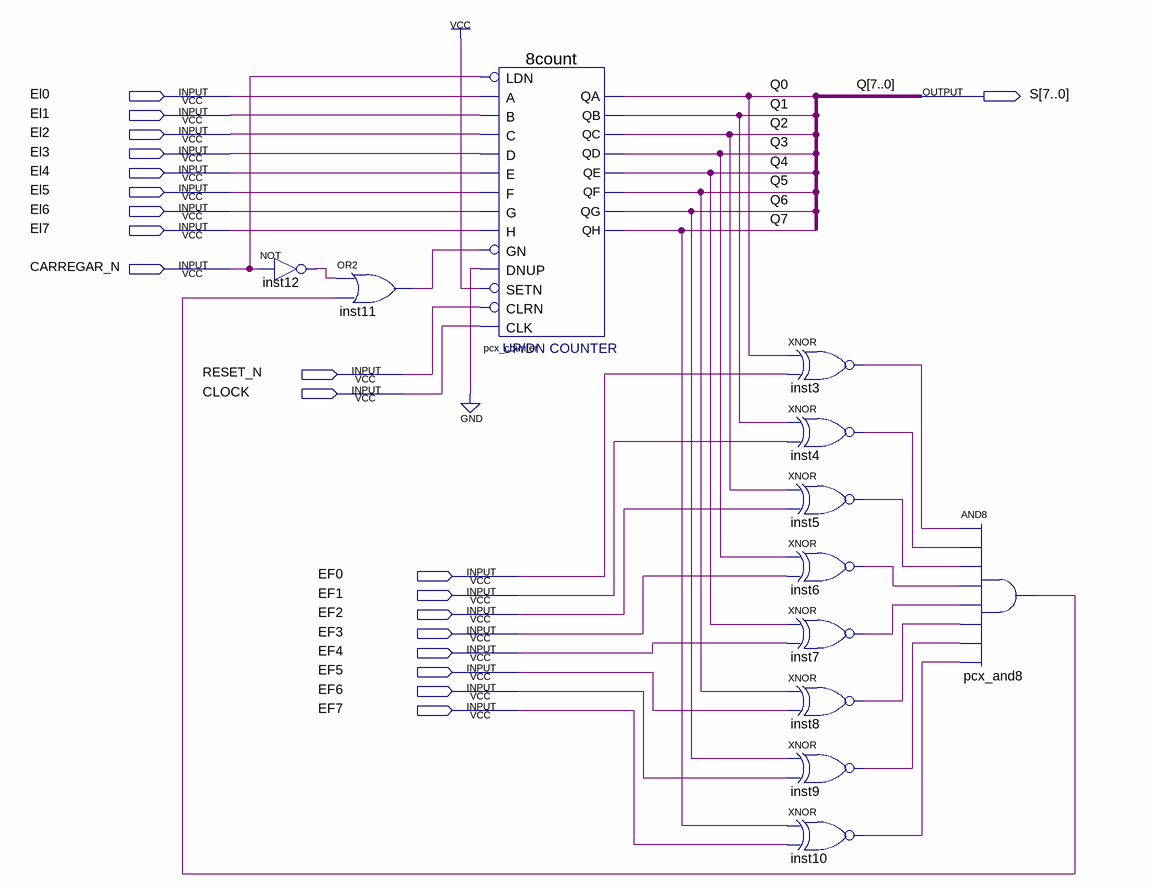
[diagram p0: schematic sheet]
// Quartus schematic PCX.bdf as structural Verilog: 12 symbols, 20 pins
module PCX (
  input  El0,
  input  El1,
  input  El2,
  input  El3,
  input  El4,
  input  El5,
  input  El6,
  input  El7,
  input  CARREGAR_N,
  input  RESET_N,
  input  CLOCK,
  input  EF0,
  input  EF1,
  input  EF2,
  input  EF3,
  input  EF4,
  input  EF5,
  input  EF6,
  input  EF7,
  output [7:0] S
);

  wire inst3_out, inst4_out, inst5_out, inst6_out, inst7_out, inst8_out, inst9_out, inst10_out, inst11_out,
       inst12_out, pcx_and8_out;

  not inst12 (inst12_out, CARREGAR_N);
  or inst11 (inst11_out, inst12_out, pcx_and8_out);
  \8count  pcx_counter (
    .B(El1), .A(El0), .LDN(CARREGAR_N), .D(El3), .C(El2), .E(El4), .F(El5), .GN(inst11_out), .H(El7),
    .G(El6), .CLRN(RESET_N), .SETN(1'b1), .DNUP(1'b0), .CLK(CLOCK), .QB(S[1]), .QA(S[0]), .QE(S[4]),
    .QD(S[3]), .QC(S[2]), .QH(S[7]), .QG(S[6]), .QF(S[5]));
  xnor inst3 (inst3_out, S[0], EF0);
  xnor inst4 (inst4_out, S[1], EF1);
  xnor inst5 (inst5_out, S[2], EF2);
  xnor inst6 (inst6_out, S[3], EF3);
  xnor inst7 (inst7_out, S[4], EF4);
  xnor inst8 (inst8_out, S[5], EF5);
  xnor inst9 (inst9_out, S[6], EF6);
  xnor inst10 (inst10_out, S[7], EF7);
  and pcx_and8 (pcx_and8_out, inst3_out, inst4_out, inst5_out, inst6_out, inst7_out, inst8_out, inst9_out, inst10_out);

  // Other names for the same wires on the sheet: Q[7:0] = S; Q0 = S[0]; Q1 = S[1]; Q2 = S[2]; Q3 = S[3]; Q4 = S[4];
  //   Q5 = S[5]; Q6 = S[6]; Q7 = S[7]
endmodule
